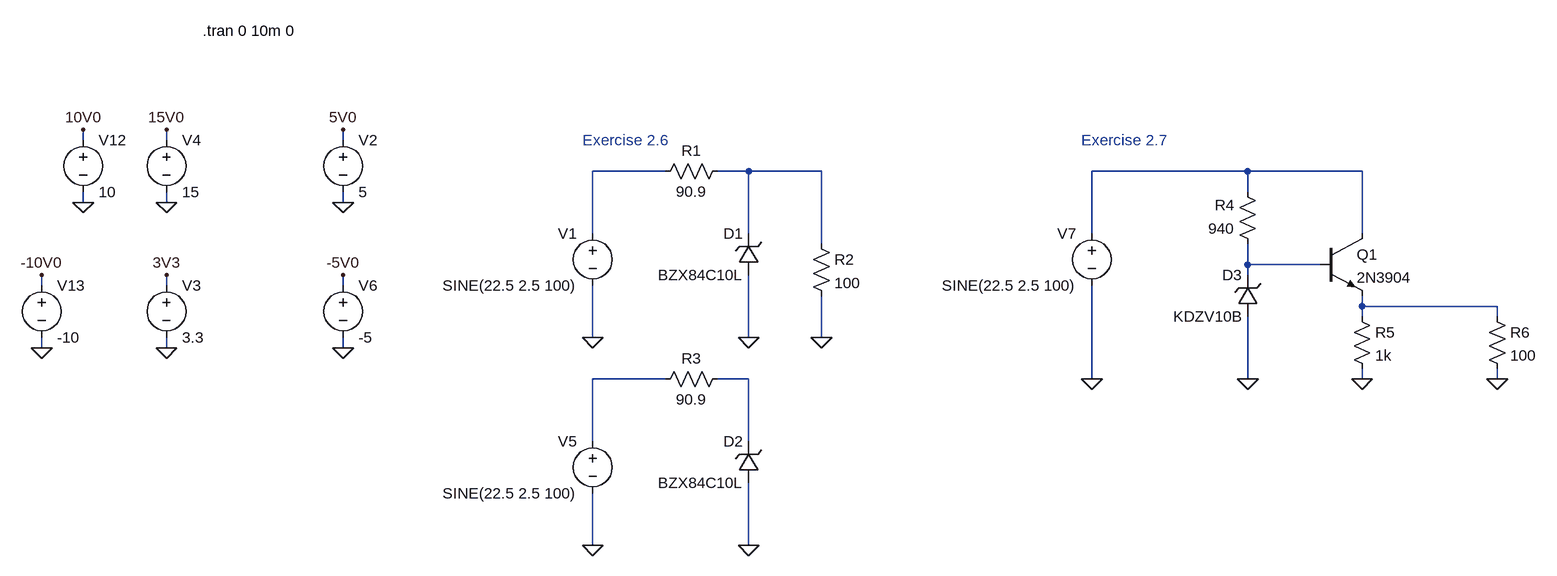
[diagram p0: schematic Zeners.asc]
Zeners.asc, the LTspice schematic file:
Version 4
SHEET 1 4136 1636
WIRE -736 384 -736 368
WIRE -608 384 -608 368
WIRE -336 384 -336 368
WIRE 160 432 48 432
WIRE 288 432 240 432
WIRE 400 432 288 432
WIRE 1056 432 816 432
WIRE 1232 432 1056 432
WIRE 1056 464 1056 432
WIRE -736 480 -736 464
WIRE -608 480 -608 464
WIRE -336 480 -336 464
WIRE 48 528 48 432
WIRE 288 528 288 432
WIRE 816 528 816 432
WIRE 1232 528 1232 432
WIRE 400 544 400 432
WIRE 1056 576 1056 544
WIRE 1168 576 1056 576
WIRE 1056 592 1056 576
WIRE -800 608 -800 592
WIRE -608 608 -608 592
WIRE -336 608 -336 592
WIRE 1232 640 1232 624
WIRE 1440 640 1232 640
WIRE 1232 656 1232 640
WIRE 1440 656 1440 640
WIRE 48 688 48 608
WIRE 288 688 288 592
WIRE 400 688 400 624
WIRE -800 704 -800 688
WIRE -608 704 -608 688
WIRE -336 704 -336 688
WIRE 160 752 48 752
WIRE 288 752 240 752
WIRE 816 752 816 608
WIRE 1056 752 1056 656
WIRE 1232 752 1232 736
WIRE 1440 752 1440 736
WIRE 48 848 48 752
WIRE 288 848 288 752
WIRE 48 1008 48 928
WIRE 288 1008 288 912
FLAG -336 480 0
FLAG -336 368 5V0
FLAG -608 480 0
FLAG -608 368 15V0
FLAG -336 704 0
FLAG -336 592 -5V0
FLAG -608 704 0
FLAG -608 592 3V3
FLAG -736 480 0
FLAG -736 368 10V0
FLAG -800 704 0
FLAG -800 592 -10V0
FLAG 48 688 0
FLAG 288 688 0
FLAG 400 688 0
FLAG 48 1008 0
FLAG 288 1008 0
FLAG 816 752 0
FLAG 1056 752 0
FLAG 1232 752 0
FLAG 1440 752 0
SYMBOL voltage -336 368 R0
WINDOW 123 0 0 Left 0
WINDOW 39 0 0 Left 0
SYMATTR InstName V2
SYMATTR Value 5
SYMBOL voltage -608 368 R0
WINDOW 123 0 0 Left 0
WINDOW 39 0 0 Left 0
SYMATTR InstName V4
SYMATTR Value 15
SYMBOL voltage -336 592 R0
WINDOW 123 0 0 Left 0
WINDOW 39 0 0 Left 0
SYMATTR InstName V6
SYMATTR Value -5
SYMBOL voltage -608 592 R0
WINDOW 123 0 0 Left 0
WINDOW 39 0 0 Left 0
SYMATTR InstName V3
SYMATTR Value 3.3
SYMBOL voltage -736 368 R0
WINDOW 123 0 0 Left 0
WINDOW 39 0 0 Left 0
SYMATTR InstName V12
SYMATTR Value 10
SYMBOL voltage -800 592 R0
WINDOW 123 0 0 Left 0
WINDOW 39 0 0 Left 0
SYMATTR InstName V13
SYMATTR Value -10
SYMBOL voltage 48 512 M0
WINDOW 123 0 0 Left 0
WINDOW 39 0 0 Left 0
SYMATTR InstName V1
SYMATTR Value SINE(22.5 2.5 100)
SYMBOL res 256 416 R90
WINDOW 0 0 56 VBottom 2
WINDOW 3 32 56 VTop 2
SYMATTR InstName R1
SYMATTR Value 90.9
SYMBOL zener 304 592 R180
WINDOW 0 24 64 Left 2
WINDOW 3 24 0 Left 2
SYMATTR InstName D1
SYMATTR Value BZX84C10L
SYMATTR Description Diode
SYMATTR Type diode
SYMBOL res 384 528 R0
SYMATTR InstName R2
SYMATTR Value 100
SYMBOL voltage 48 832 M0
WINDOW 123 0 0 Left 0
WINDOW 39 0 0 Left 0
SYMATTR InstName V5
SYMATTR Value SINE(22.5 2.5 100)
SYMBOL res 256 736 R90
WINDOW 0 0 56 VBottom 2
WINDOW 3 32 56 VTop 2
SYMATTR InstName R3
SYMATTR Value 90.9
SYMBOL zener 304 912 R180
WINDOW 0 24 64 Left 2
WINDOW 3 24 0 Left 2
SYMATTR InstName D2
SYMATTR Value BZX84C10L
SYMATTR Description Diode
SYMATTR Type diode
SYMBOL voltage 816 512 M0
WINDOW 123 0 0 Left 0
WINDOW 39 0 0 Left 0
SYMATTR InstName V7
SYMATTR Value SINE(22.5 2.5 100)
SYMBOL res 1072 560 R180
WINDOW 0 36 76 Left 2
WINDOW 3 36 40 Left 2
SYMATTR InstName R4
SYMATTR Value 940
SYMBOL zener 1072 656 R180
WINDOW 0 24 64 Left 2
WINDOW 3 24 0 Left 2
SYMATTR InstName D3
SYMATTR Value KDZV10B
SYMATTR Description Diode
SYMATTR Type diode
SYMBOL npn 1168 528 R0
SYMATTR InstName Q1
SYMATTR Value 2N3904
SYMBOL res 1216 640 R0
SYMATTR InstName R5
SYMATTR Value 1k
SYMBOL res 1424 640 R0
SYMATTR InstName R6
SYMATTR Value 100
TEXT -552 216 Left 2 !.tran 0 10m 0
TEXT 32 384 Left 2 ;Exercise 2.6
TEXT 800 384 Left 2 ;Exercise 2.7

The netlist it stands for:
* Zeners.asc
V2 5V0 0 5
V4 15V0 0 15
V6 -5V0 0 -5
V3 3V3 0 3.3
V12 10V0 0 10
V13 -10V0 0 -10
V1 N001 0 SINE(22.5 2.5 100)
R1 N002 N001 90.9
D1 0 N002 BZX84C10L
R2 N002 0 100
V5 N006 0 SINE(22.5 2.5 100)
R3 N007 N006 90.9
D2 0 N007 BZX84C10L
V7 N003 0 SINE(22.5 2.5 100)
R4 N004 N003 940
D3 0 N004 KDZV10B
Q1 N003 N004 N005 0 2N3904
R5 N005 0 1k
R6 N005 0 100
.model D D
.lib standard.dio
.model NPN NPN
.model PNP PNP
.lib standard.bjt
.tran 0 10m 0
* Exercise 2.6
* Exercise 2.7
.backanno
.end